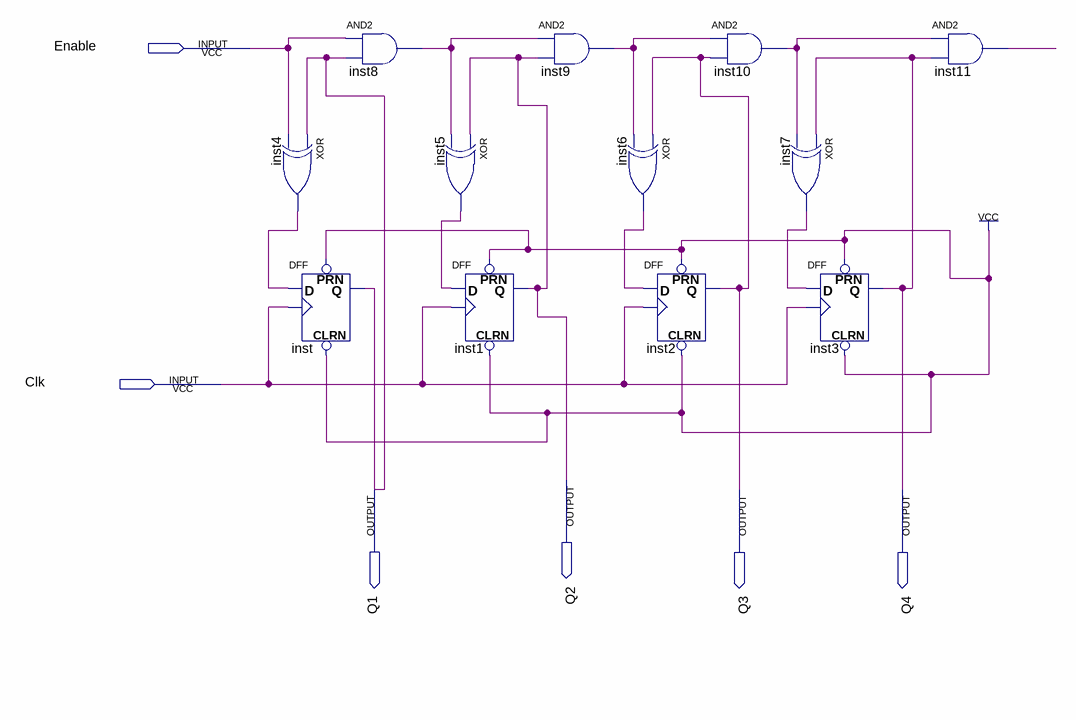
[diagram p0: schematic sheet]
// Quartus schematic lab10step2a.bdf as structural Verilog: 12 symbols, 6 pins
module lab10step2a (
  input  Enable,
  input  Clk,
  output Q2,
  output Q1,
  output Q3,
  output Q4
);

  wire inst4_out, inst5_out, inst6_out, inst7_out, inst8_out, inst9_out, inst10_out, inst11_out;

  xor inst4 (inst4_out, Q1, Enable);
  DFF inst (.CLRN(1'b1), .CLK(Clk), .D(inst4_out), .PRN(1'b1), .Q(Q1));
  and inst8 (inst8_out, Enable, Q1);
  xor inst5 (inst5_out, Q2, inst8_out);
  DFF inst1 (.CLRN(1'b1), .CLK(Clk), .D(inst5_out), .PRN(1'b1), .Q(Q2));
  and inst9 (inst9_out, inst8_out, Q2);
  xor inst6 (inst6_out, Q3, inst9_out);
  DFF inst2 (.CLRN(1'b1), .CLK(Clk), .D(inst6_out), .PRN(1'b1), .Q(Q3));
  and inst10 (inst10_out, inst9_out, Q3);
  xor inst7 (inst7_out, Q4, inst10_out);
  DFF inst3 (.CLRN(1'b1), .CLK(Clk), .D(inst7_out), .PRN(1'b1), .Q(Q4));
  and inst11 (inst11_out, inst10_out, Q4);
endmodule
